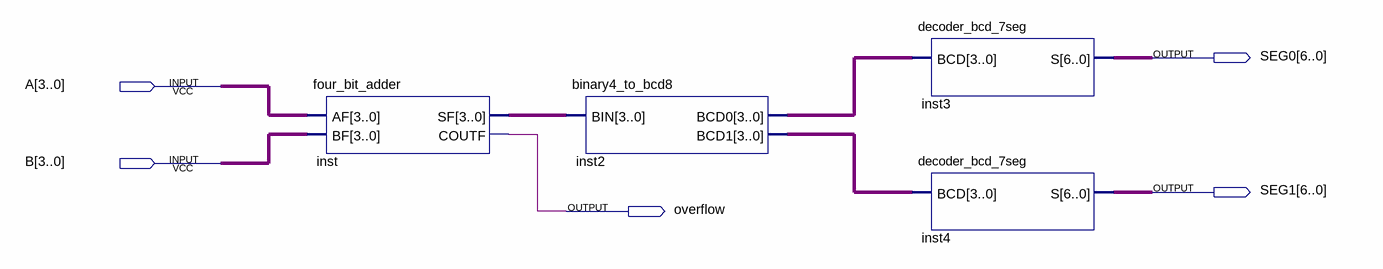
[diagram p0: schematic sheet]
// Quartus schematic class_project.bdf as structural Verilog: 4 symbols, 5 pins
module class_project (
  input  [3:0] A,
  input  [3:0] B,
  output [6:0] SEG0,
  output [6:0] SEG1,
  output overflow
);

  wire [3:0] inst2_bcd0, inst2_bcd1, inst_sf;

  four_bit_adder inst (.AF(A), .BF(B), .SF(inst_sf), .COUTF(overflow));
  binary4_to_bcd8 inst2 (.BIN(inst_sf), .BCD0(inst2_bcd0), .BCD1(inst2_bcd1));
  decoder_bcd_7seg inst3 (.BCD(inst2_bcd0), .S(SEG0));
  decoder_bcd_7seg inst4 (.BCD(inst2_bcd1), .S(SEG1));
endmodule
